# EAGLE design M7821 (EAGLE 6.6.0)
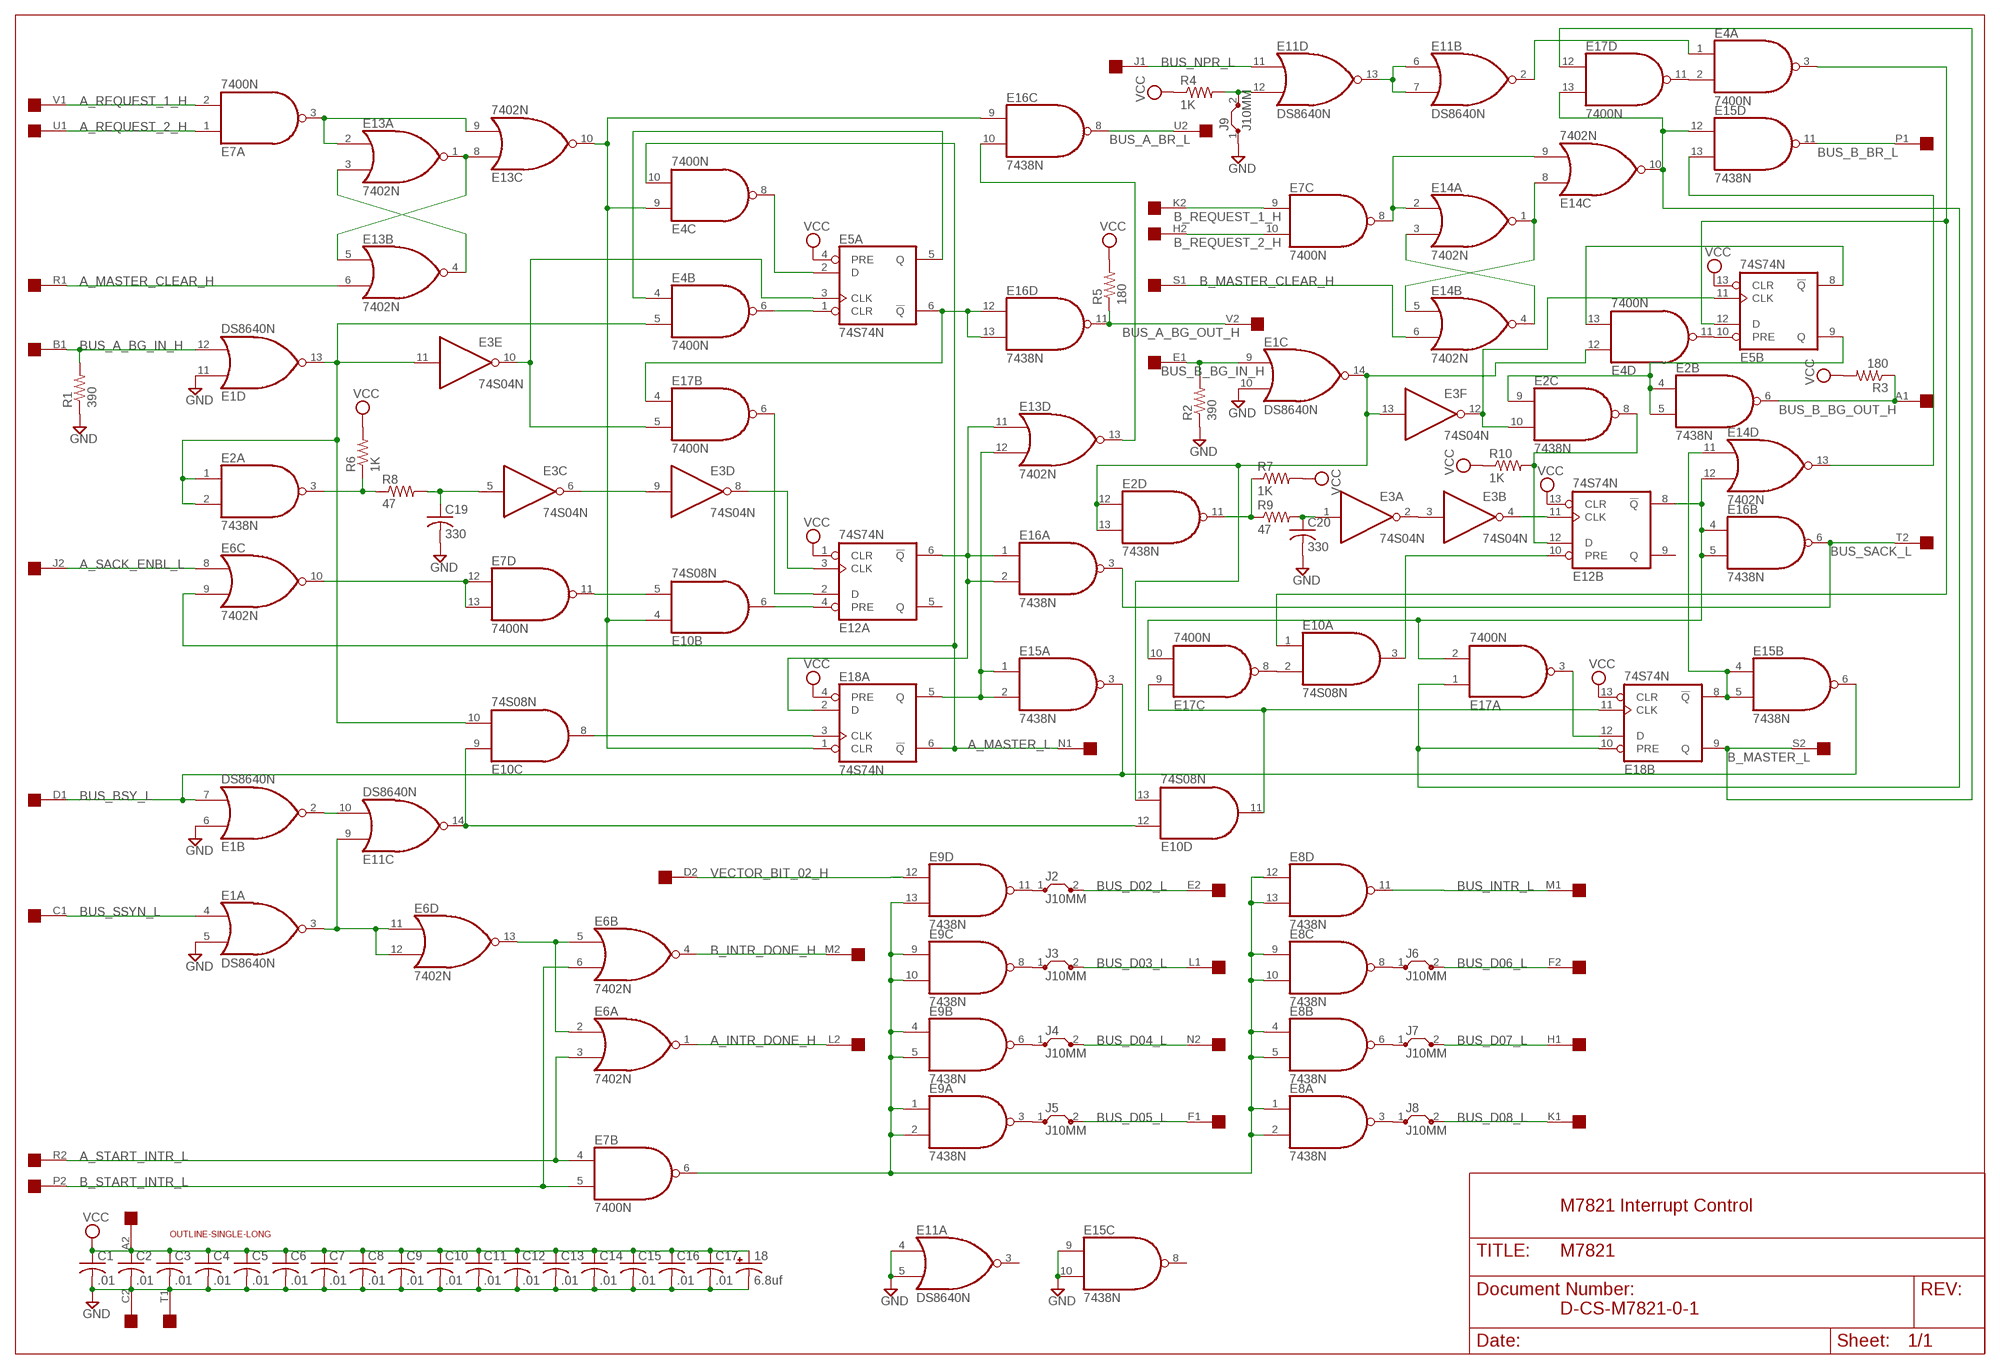
[diagram p0: schematic, sheet 1]

## Parts
18  6.8uf  CPOL-USE15-5AXIAL  [E15-5]
C1  .01  C-US050-025X075  [C050-025X075]
C2  .01  C-US050-025X075  [C050-025X075]
C3  .01  C-US050-025X075  [C050-025X075]
C4  .01  C-US050-025X075  [C050-025X075]
C5  .01  C-US050-025X075  [C050-025X075]
C6  .01  C-US050-025X075  [C050-025X075]
C7  .01  C-US050-025X075  [C050-025X075]
C8  .01  C-US050-025X075  [C050-025X075]
C9  .01  C-US050-025X075  [C050-025X075]
C10  .01  C-US050-025X075  [C050-025X075]
C11  .01  C-US050-025X075  [C050-025X075]
C12  .01  C-US050-025X075  [C050-025X075]
C13  .01  C-US050-025X075  [C050-025X075]
C14  .01  C-US050-025X075  [C050-025X075]
C15  .01  C-US050-025X075  [C050-025X075]
C16  .01  C-US050-025X075  [C050-025X075]
C17  .01  C-US050-025X075  [C050-025X075]
C19  330  C-US050-025X075  [C050-025X075]
C20  330  C-US050-025X075  [C050-025X075]
E1  DS8640N  [DIL14]
E2  7438N  [DIL14]
E3  74S04N  [DIL14]
E4  7400N  [DIL14]
E5  74S74N  [DIL14]
E6  7402N  [DIL14]
E7  7400N  [DIL14]
E8  7438N  [DIL14]
E9  7438N  [DIL14]
E10  74S08N  [DIL14]
E11  DS8640N  [DIL14]
E12  74S74N  [DIL14]
E13  7402N  [DIL14]
E14  7402N  [DIL14]
E15  7438N  [DIL14]
E16  7438N  [DIL14]
E17  7400N  [DIL14]
E18  74S74N  [DIL14]
J2  J10MM  [10]
J3  J10MM  [10]
J4  J10MM  [10]
J5  J10MM  [10]
J6  J10MM  [10]
J7  J10MM  [10]
J8  J10MM  [10]
J9  J10MM  [10]
R1  390  R-US_0207/10  [0207/10]
R2  390  R-US_0207/10  [0207/10]
R3  180  R-US_0207/10  [0207/10]
R4  1K  R-US_0207/10  [0207/10]
R5  180  R-US_0207/10  [0207/10]
R6  1K  R-US_0207/10  [0207/10]
R7  1K  R-US_0207/10  [0207/10]
R8  47  R-US_0207/10  [0207/10]
R9  47  R-US_0207/10  [0207/10]
R10  1K  R-US_0207/10  [0207/10]
U$1  OUTLINE-SINGLE-LONG  [SINGLE-LONG]
U$2  SINGLE  [EDGE-CON2]

## Nets
A_INTR_DONE_H: E6.1(A:O) U$2.L2
A_MASTER_CLEAR_H: E13.6(B:I1) U$2.R1
A_MASTER_L: E4.10(C:I1) E6.9(C:I1) E18.6(A:!Q) U$2.N1
A_REQUEST_1_H: E7.2(A:I1) U$2.V1
A_REQUEST_2_H: E7.1(A:I0) U$2.U1
A_SACK_ENBL_L: E6.8(C:I0) U$2.J2
A_START_INTR_L: E6.3(A:I1) E7.4(B:I0) U$2.R2
B_INTR_DONE_H: E6.4(B:O) U$2.M2
B_MASTER_CLEAR_H: E14.6(B:I1) U$2.S1
B_MASTER_L: E17.12(D:I0) E18.9(B:Q) U$2.S2
B_REQUEST_1_H: E7.9(C:I0) U$2.K2
B_REQUEST_2_H: E7.10(C:I1) U$2.H2
B_START_INTR_L: E6.6(B:I1) E7.5(B:I1) U$2.P2
BUS_A_BG_IN_H: E1.12(D:I1) R1.2 U$2.B1
BUS_A_BG_OUT_H: E16.11(D:O) R5.1 U$2.V2
BUS_A_BR_L: E16.8(C:O) U$2.U2
BUS_B_BG_IN_H: E1.9(C:I0) R2.2 U$2.E1
BUS_B_BG_OUT_H: E2.6(B:O) R3.1 U$2.A1
BUS_B_BR_L: E15.11(D:O) U$2.P1
BUS_BSY_L: E1.7(B:I1) E15.3(A:O) E15.6(B:O) U$2.D1
BUS_D02_L: J2.2 U$2.E2
BUS_D03_L: J3.2 U$2.L1
BUS_D04_L: J4.2 U$2.N2
BUS_D05_L: J5.2 U$2.F1
BUS_D06_L: J6.2 U$2.F2
BUS_D07_L: J7.2 U$2.H1
BUS_D08_L: J8.2 U$2.K1
BUS_INTR_L: E8.11(D:O) U$2.M1
BUS_NPR_L: E11.11(D:I0) U$2.J1
BUS_SACK_L: E16.3(A:O) E16.6(B:O) U$2.T2
BUS_SSYN_L: E1.4(A:I0) U$2.C1
GND: 18.- C1.2 C2.2 C3.2 C4.2 C5.2 C6.2 C7.2 C8.2 C9.2 C10.2 C11.2 C12.2 C13.2 C14.2 C15.2 C16.2 C17.2 C19.2 C20.2 E1.5(A:I1) E1.6(B:I0) E1.10(C:I1) E1.11(D:I0) E11.4(A:I0) E11.5(A:I1) E15.9(C:I0) E15.10(C:I1) J9.1 R1.1 R2.1 U$2.C2 U$2.T1
N$1: E1.14(C:O) E2.12(D:I0) E2.13(D:I1) E3.13(F:I) E4.12(D:I0) E10.13(D:I1)
N$2: E1.13(D:O) E2.1(A:I0) E2.2(A:I1) E3.11(E:I) E4.5(B:I1) E10.10(C:I1)
N$3: E1.3(A:O) E6.11(D:I0) E6.12(D:I1) E11.9(C:I0)
N$4: E1.2(B:O) E11.10(C:I1)
N$5: E7.8(C:O) E14.2(A:I0) E14.9(C:I1)
N$6: E11.12(D:I1) J9.2 R4.2
N$7: E11.6(B:I0) E11.7(B:I1) E11.13(D:O)
N$8: E6.10(C:O) E7.12(D:I0) E7.13(D:I1)
N$9: E14.3(A:I1) E14.4(B:O)
N$10: E9.11(D:O) J2.1
N$11: E3.8(D:O) E12.3(A:CLK)
N$12: E7.11(D:O) E10.5(B:I1)
N$13: E4.13(D:I1) E5.8(B:!Q)
N$14: E14.1(A:O) E14.5(B:I0) E14.8(C:I0)
N$15: E2.11(D:O) R7.1 R9.1
N$16: E9.3(A:O) J5.1
N$17: E9.6(B:O) J4.1
N$18: E9.8(C:O) J3.1
N$19: E10.9(C:I0) E10.12(D:I0) E11.14(C:O)
N$20: E8.3(A:O) J8.1
N$21: E8.6(B:O) J7.1
N$22: E8.8(C:O) J6.1
N$23: E7.6(B:O) E8.1(A:I0) E8.2(A:I1) E8.4(B:I0) E8.5(B:I1) E8.9(C:I0) E8.10(C:I1) E8.12(D:I0) E8.13(D:I1) E9.1(A:I0) E9.2(A:I1) E9.4(B:I0) E9.5(B:I1) E9.9(C:I0) E9.10(C:I1) E9.13(D:I1)
N$24: E12.6(A:!Q) E13.11(D:I0) E16.1(A:I0) E16.2(A:I1) E18.2(A:D)
N$25: E13.12(D:I1) E15.1(A:I0) E15.2(A:I1) E18.5(A:Q)
N$26: E4.6(B:O) E5.1(A:CLR)
N$27: E4.8(C:O) E5.2(A:D)
N$28: E4.4(B:I0) E5.5(A:Q)
N$29: E3.10(E:O) E5.3(A:CLK) E17.5(B:I1)
N$30: E12.2(A:D) E17.6(B:O)
N$31: E5.6(A:!Q) E16.12(D:I0) E16.13(D:I1) E17.4(B:I0)
N$32: E13.13(D:O) E16.10(C:I1)
N$33: C20.1 E3.1(A:I) R9.2
N$34: E6.2(A:I0) E6.5(B:I0) E6.13(D:O)
N$35: E3.2(A:O) E3.3(B:I)
N$36: E3.4(B:O) E12.11(B:CLK)
N$37: E10.6(B:O) E12.4(A:PRE)
N$38: E2.3(A:O) R6.1 R8.1
N$39: C19.1 E3.5(C:I) R8.2
N$40: E3.6(C:O) E3.9(D:I)
N$41: E10.11(D:O) E17.9(C:I0) E18.11(B:CLK)
N$42: E7.3(A:O) E13.2(A:I0) E13.9(C:I1)
N$43: E13.1(A:O) E13.5(B:I0) E13.8(C:I0)
N$44: E13.3(A:I1) E13.4(B:O)
N$45: E4.9(C:I0) E10.4(B:I0) E13.10(C:O) E16.9(C:I0) E18.1(A:CLR)
N$46: E10.8(C:O) E18.3(A:CLK)
N$47: E4.1(A:I0) E11.2(B:O)
N$48: E14.11(D:I0) E15.4(B:I0) E15.5(B:I1) E18.8(B:!Q)
N$49: E17.3(A:O) E18.12(B:D)
N$50: E14.10(C:O) E15.12(D:I0) E17.1(A:I0) E17.13(D:I1) E18.10(B:PRE)
N$51: E10.2(A:I1) E17.8(C:O)
N$52: E12.8(B:!Q) E14.12(D:I1) E16.4(B:I0) E16.5(B:I1) E17.2(A:I1) E17.10(C:I1)
N$53: E10.3(A:O) E12.10(B:PRE)
N$54: E4.3(A:O) E5.12(B:D) E10.1(A:I0)
N$55: E2.8(C:O) E12.12(B:D) R10.2
N$56: E2.10(C:I1) E3.12(F:O) E5.11(B:CLK)
N$57: E2.4(B:I0) E2.5(B:I1) E2.9(C:I0) E5.9(B:Q)
N$58: E4.11(D:O) E5.10(B:PRE)
N$60: E4.2(A:I1) E17.11(D:O)
N$61: E14.13(D:O) E15.13(D:I1)
VCC: 18.+ C1.1 C2.1 C3.1 C4.1 C5.1 C6.1 C7.1 C8.1 C9.1 C10.1 C11.1 C12.1 C13.1 C14.1 C15.1 C16.1 C17.1 E5.4(A:PRE) E5.13(B:CLR) E12.1(A:CLR) E12.13(B:CLR) E18.4(A:PRE) E18.13(B:CLR) R3.2 R4.1 R5.2 R6.2 R7.2 R10.1 U$2.A2
VECTOR_BIT_02_H: E9.12(D:I0) U$2.D2
Unconnected: E11.3(A:O) E12.5(A:Q) E12.9(B:Q) E15.8(C:O) U$2.B2

## Notes on the sheet
- M7821 Interrupt Control
- D-CS-M7821-0-1

## Power pins joined to a net without a drawn wire
GND: E1.1(P:GND) E2.7(P:GND) E3.7(P:GND) E4.7(P:GND) E5.7(P:GND) E6.7(P:GND) E7.7(P:GND) E8.7(P:GND) E9.7(P:GND) E10.7(P:GND) E11.1(P:GND) E12.7(P:GND) E13.7(P:GND) E14.7(P:GND) E15.7(P:GND) E16.7(P:GND) E17.7(P:GND) E18.7(P:GND)
VCC: E1.8(P:VCC) E2.14(P:VCC) E3.14(P:VCC) E4.14(P:VCC) E5.14(P:VCC) E6.14(P:VCC) E7.14(P:VCC) E8.14(P:VCC) E9.14(P:VCC) E10.14(P:VCC) E11.8(P:VCC) E12.14(P:VCC) E13.14(P:VCC) E14.14(P:VCC) E15.14(P:VCC) E16.14(P:VCC) E17.14(P:VCC) E18.14(P:VCC)

## Library data of the parts
18 = rcl:CPOL-US: POLARIZED CAPACITOR, American symbol
C1-C17 C19 C20 = rcl:C-US: CAPACITOR, American symbol
E1 E11 = dec-con:DS8640: Quad NOR gate
E2 E8 E9 E15 E16 = dec-con:74*38: Quad 2-input NAND gate, open collector output
E3 = 74xx-us:74*04: Hex INVERTER
E4 E7 E17 = 74xx-us:74*00: Quad 2-input NAND gate
E5 E12 E18 = 74xx-us:74*74: Dual D type positive edge triggered FLIP FLOP, preset and clear
E6 E13 E14 = 74xx-us:74*02: Quad 2-input NOR gate
E10 = 74xx-us:74*08: Quad 2-input AND gate
J2-J9 = jumper:J: Bridge
R1-R10 = rcl:R-US_: RESISTOR, American symbol
U$1 = dec-con:OUTLINE-*: Board outlines for DEC boards.
U$2 = dec-con:SINGLE: Single-Height DEC board

## Board
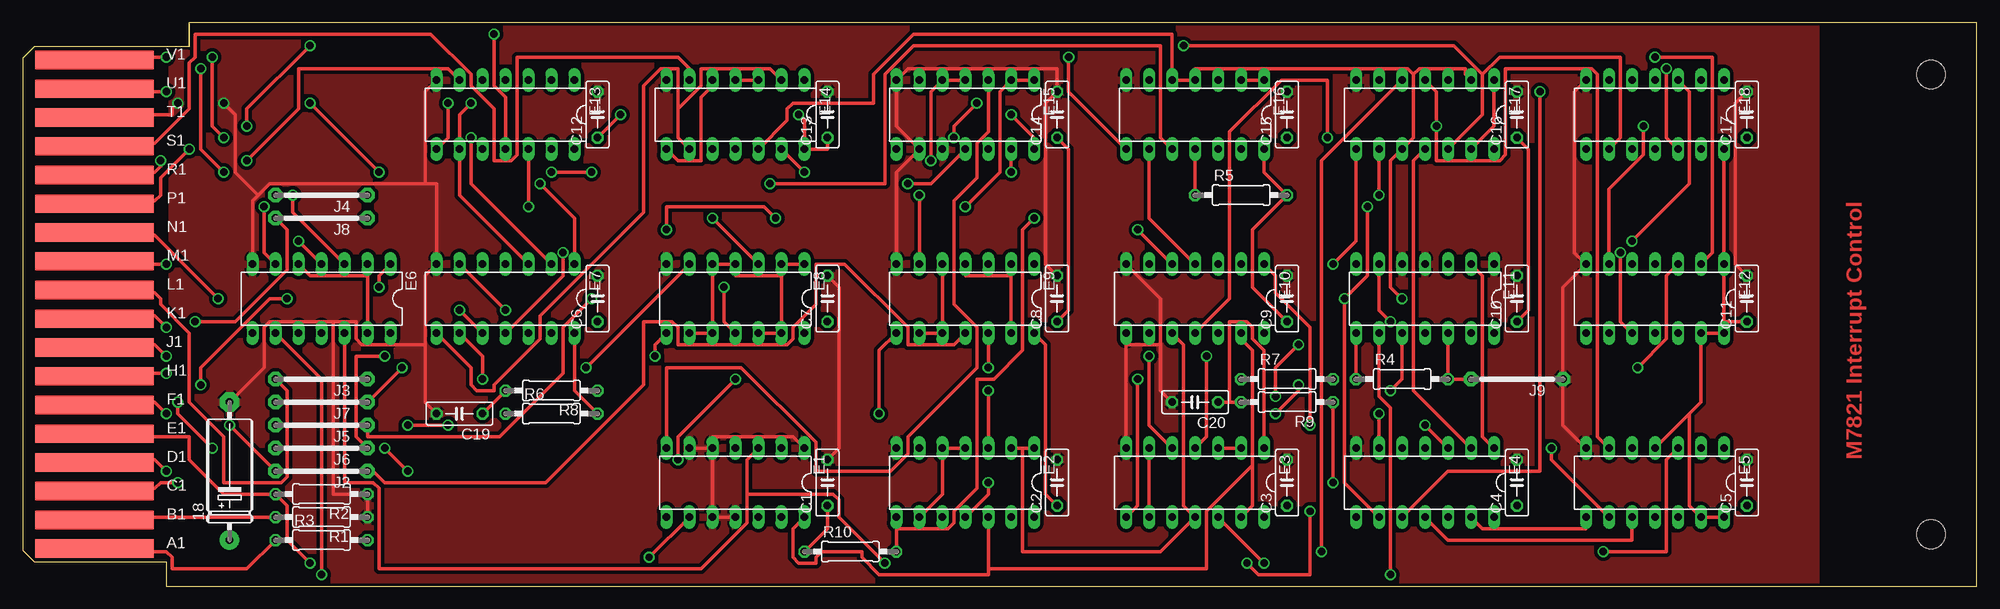
[diagram p1: board, top side]
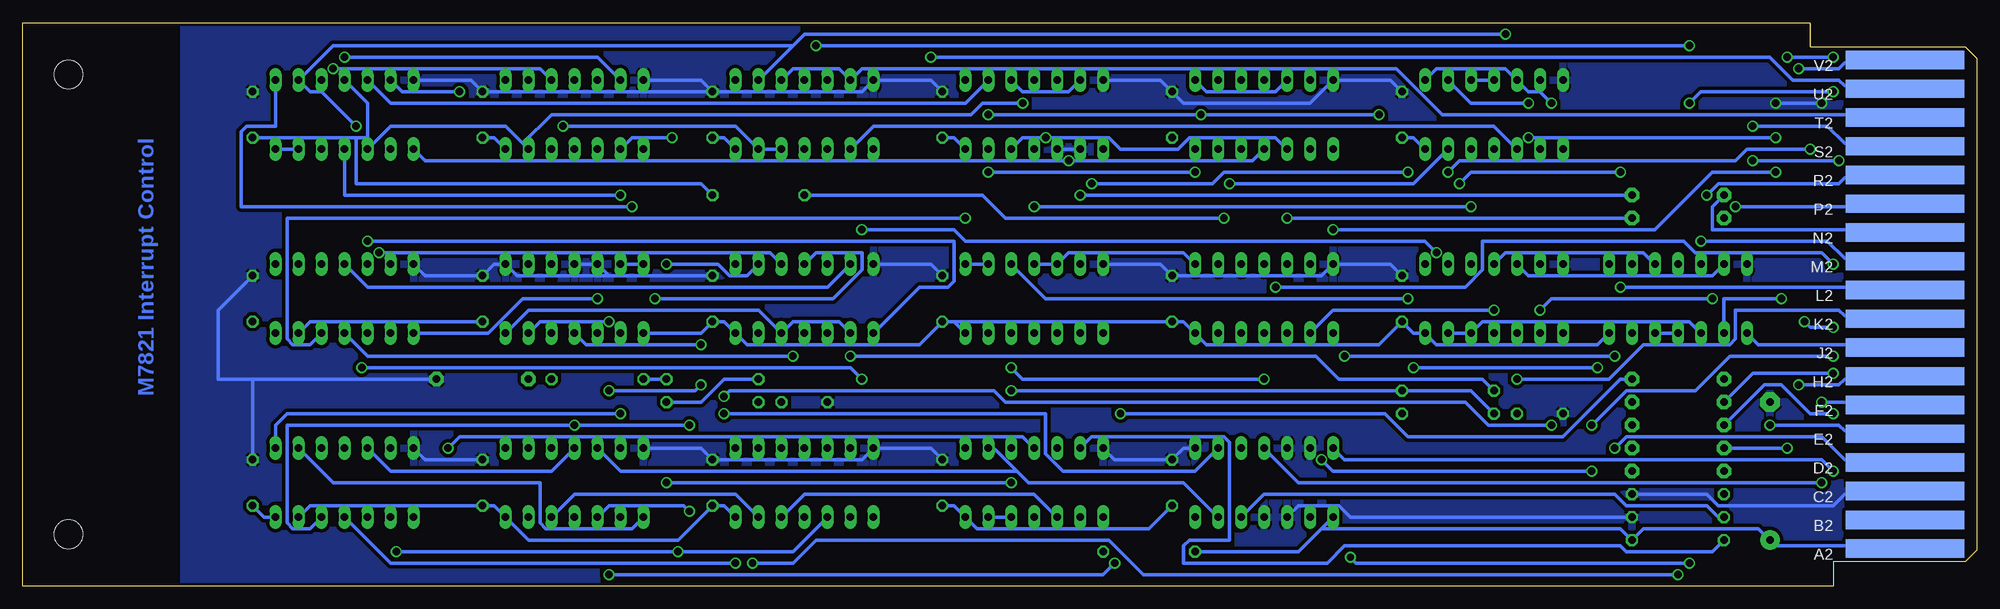
[diagram p2: board, bottom side, seen from below]

Size 215.9 x 62.23 mm. Coordinates in mm from the lower left corner, seen from the top.
Copper layers (1+16): Top 0.035mm / dielectric 1.5mm / Bottom 0.035mm
Design rules "16mils": minimum track width 16mil, minimum drill 32mil, track to track 15mil, track to pad 10mil, pad to pad 10mil, via to via 10mil, smd to smd 10mil, copper to edge 13mil, drill to drill 10mil, minimum pad ring 10mil, minimum via ring 8mil, stop-mask expansion 0mil, vias tented up to drill 0mil, thermal gap 10mil

### Footprints (pad centres in the part's own frame; a part is rotated, then mirrored left to right if it is on the bottom)
E15-5 = drill 0.813 pad 2.159: + -7.62,0 | drill 0.813 pad 2.159 octagon: - 7.62,0
C050-025X075 = drill 0.813 octagon: 1 -2.54,0; 2 2.54,0
DIL14 = drill 0.813 long: 1 -7.62,-3.81; 2 -5.08,-3.81; 3 -2.54,-3.81; 4 0,-3.81; 5 2.54,-3.81; 6 5.08,-3.81; 7 7.62,-3.81; 8 7.62,3.81; 9 5.08,3.81; 10 2.54,3.81; 11 0,3.81; 12 -2.54,3.81; 13 -5.08,3.81; 14 -7.62,3.81
10 = drill 0.813 pad 1.6 octagon: 1 -5.08,0; 2 5.08,0
0207/10 = drill 0.813 octagon: 1 -5.08,0; 2 5.08,0
SINGLE-LONG = hole 3.175: 210.82,56.515; 210.82,5.715
EDGE-CON2 = smd 13.106 x 2.032: A1 7.938,4.128; B1 7.938,7.303; C1 7.938,10.477; D1 7.938,13.652; E1 7.938,16.828; F1 7.938,20.003; H1 7.938,23.177; J1 7.938,26.352; K1 7.938,29.527; L1 7.938,32.703; M1 7.938,35.877; N1 7.938,39.053; P1 7.938,42.227; R1 7.938,45.403; S1 7.938,48.578; T1 7.938,51.752; U1 7.938,54.928; V1 7.938,58.102 | smd 13.106 x 2.032 bottom: A2 7.938,4.128; B2 7.938,7.303; C2 7.938,10.477; D2 7.938,13.652; E2 7.938,16.828; F2 7.938,20.003; H2 7.938,23.177; J2 7.938,26.352; K2 7.938,29.527; L2 7.938,32.703; M2 7.938,35.877; N2 7.938,39.053; P2 7.938,42.227; R2 7.938,45.403; S2 7.938,48.578; T2 7.938,51.752; U2 7.938,54.928; V2 7.938,58.102

### Placement (x,y rotation side)
18  22.86,12.7 90 top
C1  88.9,11.43 90 top
C2  114.3,11.43 90 top
C3  139.7,11.43 90 top
C4  165.1,11.43 90 top
C5  190.5,11.43 90 top
C6  63.5,31.75 90 top
C7  88.9,31.75 90 top
C8  114.3,31.75 90 top
C9  139.7,31.75 90 top
C10  165.1,31.75 90 top
C11  190.5,31.75 90 top
C12  63.5,52.07 90 top
C13  88.9,52.07 90 top
C14  114.3,52.07 90 top
C15  139.7,52.07 90 top
C16  165.1,52.07 90 top
C17  190.5,52.07 90 top
C19  48.26,19.05 180 top
C20  129.54,20.32 180 top
E1  78.74,11.43 180 top
E2  104.14,11.43 180 top
E3  129.54,11.43 180 top
E4  154.94,11.43 180 top
E5  180.34,11.43 180 top
E6  33.02,31.75 180 top
E7  53.34,31.75 180 top
E8  78.74,31.75 180 top
E9  104.14,31.75 180 top
E10  129.54,31.75 180 top
E11  154.94,31.75 180 top
E12  180.34,31.75 180 top
E13  53.34,52.07 180 top
E14  78.74,52.07 180 top
E15  104.14,52.07 180 top
E16  129.54,52.07 180 top
E17  154.94,52.07 180 top
E18  180.34,52.07 180 top
J2  33.02,12.7 180 top
J3  33.02,22.86 180 top
J4  33.02,43.18 180 top
J5  33.02,17.78 180 top
J6  33.02,15.24 180 top
J7  33.02,20.32 180 top
J8  33.02,40.64 180 top
J9  165.1,22.86 180 top
R1  33.02,7.62 180 top
R2  33.02,10.16 180 top
R3  33.02,5.08 0 top
R4  152.4,22.86 0 top
R5  134.62,43.18 0 top
R6  58.42,19.05 0 top
R7  139.7,22.86 0 top
R8  58.42,21.59 180 top
R9  139.7,20.32 180 top
R10  91.44,3.81 0 top
U$1  0,0 0 top
U$2  0,0 0 top

### Tracks (layer width: path | path; a pad name or v marks a point on that pad's centre or on a via)
A_INTR_DONE_H  (via drill 0.81)
  Top 0.406: E6.1 39.37,34.29 v39.37,33.02
  Bottom 0.406: v39.37,33.02 8.26,33.02 U$2.L2
A_MASTER_CLEAR_H  (via drill 0.81)
  Top 0.406: E13.6 46.99,57.15 30.48,57.15 30.48,52.7 v24.77,46.99 | v15.24,46.99 15.24,46.35 14.61,45.72 8.26,45.72 U$2.R1
  Bottom 0.406: v15.24,46.99 v24.77,46.99
A_MASTER_L  (via drill 0.81)
  Top 0.406: v21.59,31.75 14.61,38.73 8.26,38.73 U$2.N1 | E4.10 157.48,12.7 167.64,12.7 v167.64,54.61 | E6.9 33.02,22.86 v33.02,1.27 | v135.26,2.54 136.53,1.27 142.24,1.27 v142.24,8.26
  Bottom 0.406: E6.9 27.94,31.75 v21.59,31.75 | v167.64,54.61 173.99,54.61 E18.6 | v33.02,1.27 92.08,1.27 95.89,5.08 128.27,5.08 130.81,2.54 v135.26,2.54 | v142.24,8.26 142.88,8.89 151.13,8.89 E4.10
A_REQUEST_1_H  (via drill 0.81)
  Top 0.406: E7.2 49.53,44.45 v49.53,49.53 | v22.23,49.53 20.96,50.8 v20.96,58.42 | v15.88,58.42 8.26,58.42 U$2.V1
  Bottom 0.406: v22.23,49.53 v49.53,49.53 | v15.88,58.42 v20.96,58.42
A_REQUEST_2_H  (via drill 0.81)
  Top 0.406: E7.1 60.96,40.64 v57.15,44.45 | v31.75,53.34 v39.37,45.72 | v15.88,54.61 8.26,54.61 U$2.U1
  Bottom 0.406: v57.15,44.45 55.88,45.72 v39.37,45.72 | v31.75,53.34 30.48,54.61 v15.88,54.61
A_SACK_ENBL_L
  Bottom 0.406: E6.8 24.13,26.67 8.26,26.67 U$2.J2
A_START_INTR_L  (via drill 0.81)
  Top 0.406: E6.3 29.85,41.27 v29.85,43.18
  Bottom 0.406: E6.3 36.83,36.83 52.07,36.83 E7.4 | v29.85,43.18 28.58,44.45 15.24,44.45 14.61,45.09 8.26,45.09 U$2.R2
B_INTR_DONE_H  (via drill 0.81)
  Top 0.406: v30.48,38.1 E6.4
  Bottom 0.406: v30.48,38.1 16.51,38.1 14.61,36.2 8.26,36.2 U$2.M2
B_MASTER_CLEAR_H
  Top 0.406: E14.6 73.66,57.15 72.39,58.42 54.61,58.42 54.61,47.62 53.98,46.99 52.07,46.99 52.07,52.7 49.53,55.24 49.53,56.52 45.09,60.96 19.05,60.96 19.05,58.42 18.42,57.78 18.42,52.7 14.61,48.9 8.26,48.9 U$2.S1
B_MASTER_L  (via drill 0.81)
  Top 0.406: E17.12 161.29,52.07 161.29,56.52 | 161.29,56.52 163.2,58.42 176.53,58.42 176.53,49.53 E18.9 | 161.29,56.52 158.12,59.69 v128.27,59.69 | v31.75,59.69 24.77,52.7 v24.77,50.8
  Bottom 0.406: v31.75,59.69 v128.27,59.69 | v24.77,50.8 16.51,50.8 14.61,48.9 8.26,48.9 U$2.S2
B_REQUEST_1_H  (via drill 0.81)
  Top 0.406: E7.9 50.8,25.4 v50.8,22.86
  Bottom 0.406: v50.8,22.86 40.64,22.86 36.83,26.67 27.31,26.67 26.67,27.3 26.67,30.48 15.24,30.48 14.61,29.84 8.26,29.84 U$2.K2
B_REQUEST_2_H  (via drill 0.81)
  Top 0.406: v48.26,30.48 E7.10 | v29.21,31.75 27.31,31.75 19.69,24.13 v19.69,22.23
  Bottom 0.406: v48.26,30.48 46.99,31.75 v29.21,31.75 | v19.69,22.23 15.24,22.23 14.61,22.86 8.26,22.86 U$2.H2
B_START_INTR_L  (via drill 0.81)
  Top 0.406: E6.6 26.67,36.83 v26.67,41.91
  Bottom 0.406: E6.6 29.21,34.29 49.53,34.29 E7.5 | v26.67,41.91 8.26,41.91 U$2.P2
BUS_A_BG_IN_H
  Top 0.406: R1.2 8.26,7.62 U$2.B1
  Bottom 0.406: E1.12 78.74,10.16 40.01,10.16 38.74,8.89 29.85,8.89 28.58,7.62 R1.2
BUS_A_BG_OUT_H  (via drill 0.81)
  Top 0.406: E16.11 R5.1 | v83.19,40.64 81.92,41.91 71.12,41.91 v71.12,39.37 | v22.23,45.72 19.69,48.26 v19.69,57.15
  Bottom 0.406: R5.1 109.86,43.18 107.32,40.64 v83.19,40.64 | v71.12,39.37 35.56,39.37 29.21,45.72 v22.23,45.72 | v19.69,57.15 15.24,57.15 14.61,57.78 8.26,57.78 U$2.V2
BUS_A_BR_L  (via drill 0.81)
  Top 0.406: E16.8 115.57,54.61 v115.57,58.42
  Bottom 0.406: v115.57,58.42 22.86,58.42 20.32,55.88 15.24,55.88 14.61,55.24 8.26,55.24 U$2.U2
BUS_B_BG_IN_H  (via drill 0.81)
  Top 0.406: v69.22,3.17 E1.9 | v31.75,2.54 29.21,5.08 29.21,8.89 R2.2 22.23,10.16 18.42,13.97 18.42,16.51 8.26,16.51 U$2.E1
  Bottom 0.406: v69.22,3.17 68.58,2.54 v31.75,2.54
BUS_B_BG_OUT_H
  Top 0.406: R3.1 24.77,1.91 16.51,1.91 16.51,3.17 15.88,3.81 8.26,3.81 U$2.A1
  Bottom 0.406: E2.6 97.79,16.51 83.19,16.51 82.55,15.88 82.55,5.08 87,5.08 87.63,4.45 87.63,2.54 71.76,2.54 69.85,4.45 39.37,4.45 38.74,3.81 29.21,3.81 R3.1
BUS_B_BR_L  (via drill 0.81)
  Top 0.406: E15.11 100.33,44.45 v97.79,44.45 | v58.42,45.72 v62.87,45.72 | v18.42,48.26 15.24,45.09 15.24,43.18 14.61,42.55 8.26,42.55 U$2.P1
  Bottom 0.406: v97.79,44.45 84.46,44.45 83.19,45.72 v62.87,45.72 | v58.42,45.72 57.15,46.99 26.67,46.99 25.4,48.26 v18.42,48.26
BUS_BSY_L  (via drill 0.81)
  Top 0.406: v15.88,12.7 14.61,13.97 8.26,13.97 U$2.D1 | E15.3 106.68,50.16 105.41,48.9 105.41,45.09 102.87,42.55 102.87,31.11 105.41,28.57 105.41,24.13 97.79,16.51 97.79,14.61 95.89,12.7 87.63,12.7 87.63,15.88 79.38,24.13 71.12,24.13 E1.7
  Bottom 0.406: E15.6 100.33,54.61 105.41,54.61 E15.3 | E1.7 69.85,13.97 17.15,13.97 v15.88,12.7
BUS_D02_L  (via drill 0.81)
  Top 0.406: v22.86,17.78 J2.2
  Bottom 0.406: v22.86,17.78 15.24,17.78 14.61,17.14 8.26,17.14 U$2.E2
BUS_D03_L
  Top 0.406: J3.2 29.21,21.59 29.21,12.06 28.58,11.43 22.23,11.43 22.23,16.51 18.42,20.32 18.42,27.94 15.24,31.11 15.24,31.75 14.61,32.38 8.26,32.38 U$2.L1
BUS_D04_L
  Bottom 0.406: J4.2 29.21,41.91 29.21,39.37 8.26,39.37 U$2.N2
BUS_D05_L  (via drill 0.81)
  Top 0.406: v15.88,19.05 14.61,20.32 8.26,20.32 U$2.F1
  Bottom 0.406: J5.2 23.5,22.23 21.59,22.23 18.42,19.05 v15.88,19.05
BUS_D06_L  (via drill 0.81)
  Top 0.406: v20.96,15.24 17.15,19.05 v17.15,20.32
  Bottom 0.406: v20.96,15.24 J6.2 | v17.15,20.32 8.26,20.32 U$2.F2
BUS_D07_L  (via drill 0.81)
  Top 0.406: v15.88,23.5 8.26,23.5 U$2.H1
  Bottom 0.406: J7.2 24.77,23.5 v15.88,23.5
BUS_D08_L  (via drill 0.81)
  Top 0.406: J8.2 29.21,39.37 29.21,34.92 23.5,29.21 v19.05,29.21 | v15.88,28.57 14.61,29.84 8.26,29.84 U$2.K1
  Bottom 0.406: v19.05,29.21 18.42,28.57 v15.88,28.57
BUS_INTR_L  (via drill 0.81)
  Top 0.406: E8.11 77.47,29.21 v77.47,33.02 | v15.88,35.56 8.26,35.56 U$2.M1
  Bottom 0.406: v77.47,33.02 56.52,33.02 54.61,34.92 54.61,38.1 32.39,38.1 31.12,36.83 17.15,36.83 v15.88,35.56
BUS_NPR_L  (via drill 0.81)
  Top 0.406: v140.97,26.67 138.43,24.13 v138.43,20.95 | v42.55,17.78 v46.99,17.78 | v15.88,25.4 14.61,26.67 8.26,26.67 U$2.J1
  Bottom 0.406: E11.11 153.67,26.67 v140.97,26.67 | v138.43,20.95 137.8,21.59 108.59,21.59 107.32,20.32 56.52,20.32 53.98,17.78 v46.99,17.78 | v42.55,17.78 38.74,21.59 31.12,21.59 27.31,25.4 v15.88,25.4
BUS_SACK_L
  Bottom 0.406: E16.3 130.81,57.15 125.73,57.15 E16.6 123.19,57.15 64.14,57.15 59.06,52.07 8.26,52.07 U$2.T2
BUS_SSYN_L  (via drill 0.81)
  Top 0.406: v17.15,11.43 15.24,11.43 14.61,10.79 8.26,10.79 U$2.C1
  Bottom 0.406: E1.4 74.93,11.43 v17.15,11.43
GND  (via drill 0.81)
  Top 0.406: R1.1 R2.1 34.29,10.16 34.29,29.21 | C19.2 44.45,20.32 44.45,26.67 | 44.45,26.67 44.45,34.29 E7.7 45.72,44.45 44.45,44.45 | E6.7 25.4,42.55 26.04,43.18 | 26.04,43.18 27.31,44.45 44.45,44.45 | E13.7 44.45,54.61 44.45,44.45 | 18.- 26.67,24.13 26.67,28.57 27.31,29.21 34.29,29.21 | 34.29,29.21 36.83,29.21 36.83,27.3 37.47,26.67 44.45,26.67 | v17.15,53.34 16.51,52.7 16.51,52.07 8.26,52.07 U$2.T1 | v22.23,53.34 23.5,52.07 23.5,45.72 26.04,43.18 | C17.2 189.23,53.34 189.23,35.56 C11.2 | E5.7 170.18,17.78 J9.1 170.18,33.02 E12.7 171.45,36.83 171.45,54.61 E18.7 | E1.11 E1.10 E1.5 | E1.5 E1.6 | E1.1 85.09,16.51 76.2,16.51 E1.5 | C1.2 90.17,15.24 90.17,33.02 C7.2 | E9.7 96.52,45.72 E15.9 96.52,50.8 E15.7 97.79,57.15 114.3,57.15 C14.2 113.03,53.34 113.03,35.56 C8.2 | C20.2 125.73,21.59 125.73,26.67 | 125.73,26.67 125.73,31.75 E10.7 | 125.73,26.67 121.92,26.67 E3.7
  Bottom 0.406: R2.1 29.85,10.16 28.58,8.89 15.88,8.89 14.61,10.16 8.26,10.16 U$2.C2 | v22.23,53.34 v17.15,53.34 | E12.7 171.45,34.29 C10.2 163.83,35.56 E11.1 161.29,34.29 151.13,34.29 | 151.13,34.29 C9.2 | 151.13,34.29 E11.5 E11.4 | C4.2 171.45,13.97 E5.7 | 190.5,22.86 C5.2 | J9.1 190.5,22.86 | C11.2 194.31,30.48 194.31,22.86 190.5,22.86 | C12.2 64.77,55.88 E14.7 73.66,53.34 87.63,53.34 C13.2 90.17,55.88 E15.7 | E15.10 E15.9 | E1.1 87.63,15.24 C1.2 95.25,13.97 E2.7 | C6.2 64.77,35.56 E8.7 72.39,34.29 C7.2 90.17,35.56 E9.7 | C8.2 115.57,35.56 E10.7 | C2.2 115.57,15.24 E3.7 123.19,13.97 C3.2 140.97,15.24 E4.7 | E18.7 166.37,55.88 C16.2 C15.2 | C14.2 115.57,55.88 E16.7 123.19,54.61 C15.2 | C15.2 140.97,55.88 E17.7 | R1.1 69.22,7.62 70.49,8.89 74.93,8.89 E1.10
  pour Top: 16.51,62.23 198.12,62.23 198.12,0 16.51,0
  pour Bottom: 13.97,62.23 198.12,62.23 198.12,2.54 13.97,2.54
  pour Bottom: 15.24,62.23 198.12,62.23 198.12,0 15.24,0
N$1
  Top 0.406: E1.14 85.09,6.35 85.09,3.17 85.73,2.54 87.63,2.54 87.63,3.17 88.27,3.81 92.71,3.81 92.71,3.17 94.62,1.27 106.68,1.27 106.68,1.91 | E2.12 106.68,1.91 | E3.13 135.89,8.89 135.89,13.34 | 135.89,13.34 135.89,26.04 134.62,27.3 E10.13 | 106.68,1.91 130.81,1.91 130.81,8.26 135.89,13.34
  Bottom 0.406: E2.12 E2.13 | E4.12 154.94,10.16 137.16,10.16 E3.13
N$2
  Top 0.406: E10.10 128.27,26.67 128.27,8.89 E3.11 125.73,3.81 110.49,3.81 110.49,15.24 | E2.2 110.49,15.24 | 110.49,15.24 E2.1
  Bottom 0.406: E1.13 87.63,11.43 104.78,11.43 106.05,12.7 | 106.05,12.7 108.59,15.24 E2.2 | E4.5 149.86,12.7 106.05,12.7
N$3  (via drill 0.81)
  Top 0.406: E1.3 80.01,13.97 80.01,10.16 | 80.01,10.16 80.01,6.99 74.93,1.91 39.37,1.91 39.37,10.79 38.74,11.43 35.56,11.43 E6.12 | E11.9 149.86,20.95 151.13,19.68 v151.13,1.27 | v95.25,2.54 90.17,7.62 90.17,9.53 89.54,10.16 80.01,10.16
  Bottom 0.406: E6.12 E6.11 | v151.13,1.27 96.52,1.27 v95.25,2.54
N$4  (via drill 0.81)
  Top 0.406: v138.43,19.05 140.97,21.59 v140.97,22.23 | v151.13,21.59 152.4,22.86 E11.10
  Bottom 0.406: E1.2 86.36,12.7 100.97,12.7 102.87,14.61 102.87,19.05 v138.43,19.05 | v140.97,22.23 141.61,21.59 v151.13,21.59
N$5
  Top 0.406: E7.8 49.53,24.13 49.53,22.23 50.17,21.59 52.07,21.59 52.07,22.23 57.15,27.3 57.15,29.84 68.58,41.27 68.58,55.24 70.49,57.15 72.39,57.15 72.39,52.7 | 72.39,52.7 72.39,49.53 E14.9 | E14.2 82.55,57.15 74.93,57.15 74.93,55.24 72.39,52.7
N$6
  Top 0.406: J9.2 R4.2 E11.12
N$7  (via drill 0.81)
  Top 0.406: v151.13,29.21 149.86,30.48 E11.6
  Bottom 0.406: E11.6 E11.7 | E11.13 158.75,29.21 v151.13,29.21
N$8
  Bottom 0.406: E6.10 31.75,29.21 54.61,29.21 E7.12 E7.13
N$9
  Top 0.406: E14.3 E14.4
N$10
  Top 0.406: E9.11 102.87,26.67 97.79,26.67 97.79,28.57 90.81,35.56 87.63,35.56 87.63,31.11 85.09,28.57 85.09,27.3 84.46,26.67 72.39,26.67 72.39,28.57 71.76,29.21 68.58,29.21 68.58,22.23 57.79,11.43 40.01,11.43 38.74,12.7 J2.1
N$11  (via drill 0.81)
  Top 0.406: E3.8 123.19,8.89 v123.19,22.86 | v178.44,24.13 181.61,27.3 181.61,34.29 E12.3
  Bottom 0.406: v123.19,22.86 124.46,24.13 v178.44,24.13
N$12  (via drill 0.81)
  Top 0.406: E7.11 59.69,34.29 v59.69,36.83 | E10.5 v123.19,39.37
  Bottom 0.406: v59.69,36.83 60.96,38.1 111.76,38.1 113.03,39.37 v123.19,39.37
N$13
  Top 0.406: E4.13 161.29,6.35 172.72,6.35 E5.8
N$14
  Top 0.406: E14.8 72.39,46.99 74.93,46.99 74.93,53.98 76.2,55.24 E14.5
  Bottom 0.406: E14.1 85.09,54.61 77.47,54.61 E14.5
N$15  (via drill 0.81)
  Top 0.406: E2.11 106.68,10.16 v106.68,11.43 | R9.1 v144.78,11.43
  Bottom 0.406: v144.78,11.43 v106.68,11.43 | R7.1 138.43,22.86 140.97,20.32 R9.1
N$16  (via drill 0.81)
  Top 0.406: v62.87,31.75 59.69,28.57 59.69,23.5 52.71,16.51 38.1,16.51 J5.1
  Bottom 0.406: E9.3 102.87,31.75 v62.87,31.75
N$17  (via drill 0.81)
  Top 0.406: v99.06,43.18 E9.6
  Bottom 0.406: J4.1 v99.06,43.18
N$18  (via drill 0.81)
  Top 0.406: E9.8 94.62,26.04 v94.62,19.05
  Bottom 0.406: v94.62,19.05 65.41,19.05 62.87,16.51 45.72,16.51 39.37,22.86 J3.1
N$19
  Bottom 0.406: E10.9 125.73,29.21 130.81,29.21 E10.12 134.62,30.48 160.02,30.48 E11.14
N$20  (via drill 0.81)
  Top 0.406: v76.2,40.64 E8.3
  Bottom 0.406: J8.1 v76.2,40.64
N$21  (via drill 0.81)
  Top 0.406: v62.23,24.13 E8.6 | J7.1 v41.91,24.13
  Bottom 0.406: v41.91,24.13 v62.23,24.13
N$22  (via drill 0.81)
  Top 0.406: E8.8 69.85,26.67 v69.85,25.4 | v40.01,25.4 36.83,25.4 36.83,16.51 J6.1
  Bottom 0.406: v40.01,25.4 v69.85,25.4
N$23  (via drill 0.81)
  Top 0.406: E9.2 109.22,34.29 | 109.22,34.29 E9.13 | E9.9 E9.10 E9.5 | 109.22,34.29 104.14,34.29 E9.4 | E8.12 E8.13 83.82,34.29 | E8.1 E8.2 83.82,34.29 | E8.9 E8.10 E8.5 E8.4 78.74,34.29 83.82,34.29 | v53.34,30.48 E7.6
  Bottom 0.406: E9.2 E9.1 | E9.4 E9.5 100.33,36.83 87.63,36.83 E8.1 | v53.34,30.48 71.12,30.48 E8.9
N$24  (via drill 0.81)
  Top 0.406: E12.6 175.26,43.81 179.07,47.62 v179.07,50.8 | E13.11 53.34,53.98 52.07,55.24 v52.07,60.96 | E16.2 E16.1
  Bottom 0.406: v179.07,50.8 182.88,54.61 184.15,54.61 E18.2 181.61,59.69 130.81,59.69 | v52.07,60.96 129.54,60.96 130.81,59.69 | E16.2 130.81,59.69
N$25  (via drill 0.81)
  Top 0.406: v55.88,41.91 E13.12 | v104.14,41.91 107.95,45.72 107.95,54.61 E15.2 E15.1
  Bottom 0.406: v104.14,41.91 v55.88,41.91 | E18.5 175.26,53.34 111.76,53.34 E15.2
N$26  (via drill 0.81)
  Top 0.406: v149.86,19.05 E4.6
  Bottom 0.406: v149.86,19.05 186.69,19.05 187.96,17.78 E5.1
N$27
  Bottom 0.406: E4.8 148.59,6.35 158.12,6.35 158.75,6.99 158.75,11.43 181.61,11.43 E5.2
N$28
  Bottom 0.406: E4.4 157.48,12.7 175.26,12.7 E5.5
N$29  (via drill 0.81)
  Top 0.406: v174.63,3.81 181.61,3.81 181.61,13.97 E5.3 | E17.5 143.51,46.99 v143.51,3.81
  Bottom 0.406: E3.10 130.81,3.81 v143.51,3.81 v174.63,3.81
N$30  (via drill 0.81)
  Top 0.406: v180.34,58.42 186.69,58.42 186.69,36.83 E12.2
  Bottom 0.406: E17.6 152.4,58.42 v180.34,58.42
N$31  (via drill 0.81)
  Top 0.406: E5.6 173.99,16.51 173.99,56.52 173.36,57.15 163.83,57.15 163.83,47.62 163.2,46.99 156.21,46.99 v156.21,50.8 156.21,54.61 E17.4
  Bottom 0.406: E16.12 E16.13 137.16,50.8 v156.21,50.8
N$32  (via drill 0.81)
  Top 0.406: v82.55,44.45 95.25,44.45 95.25,56.52 98.43,59.69 125.73,59.69 125.73,49.53 E16.10
  Bottom 0.406: E13.13 62.23,44.45 v82.55,44.45
N$33
  Top 0.406: R9.2 133.35,20.32 | 133.35,20.32 C20.1 | E3.1 137.16,26.04 135.89,27.3 135.89,28.57 135.26,29.21 133.35,29.21 133.35,20.32
N$34
  Top 0.406: E6.5 31.75,34.29 38.1,34.29 | E6.2 38.1,34.29 | 38.1,34.29 E6.13
N$35
  Top 0.406: E3.2 E3.3
N$36  (via drill 0.81)
  Top 0.406: E3.4 130.81,16.51 v130.81,25.4
  Bottom 0.406: v130.81,25.4 177.8,25.4 E12.11
N$37
  Bottom 0.406: E10.6 127,33.02 177.8,33.02 E12.4
N$38  (via drill 0.81)
  Top 0.406: v106.68,21.59 E2.3
  Bottom 0.406: R6.1 55.88,21.59 R8.1 v106.68,21.59
N$39  (via drill 0.81)
  Top 0.406: R8.2 C19.1 | E3.5 124.46,17.78 v124.46,25.4
  Bottom 0.406: v124.46,25.4 73.03,25.4 70.49,22.86 54.61,22.86 R8.2
N$40
  Top 0.406: E3.6 E3.9
N$41  (via drill 0.81)
  Top 0.406: E10.11 133.35,31.75 133.35,50.16 139.07,55.88 144.15,55.88 v144.15,49.53 | E17.9 v149.86,43.18
  Bottom 0.406: v144.15,49.53 148.59,49.53 E17.9 | E18.11 180.34,43.18 v149.86,43.18
N$42  (via drill 0.81)
  Top 0.406: E7.3 48.26,43.18 E13.9 48.26,52.07 v49.53,53.34
  Bottom 0.406: E13.2 55.88,53.34 v49.53,53.34
N$43  (via drill 0.81)
  Top 0.406: E13.8 46.99,49.53 v46.99,53.34
  Bottom 0.406: v46.99,53.34 48.26,54.61 49.53,54.61 E13.5 52.07,57.15 59.69,57.15 E13.1
N$44
  Bottom 0.406: E13.3 E13.4
N$45  (via drill 0.81)
  Top 0.406: E10.4 124.46,40.64 E16.9 | E4.9 146.05,11.43 v146.05,31.75 148.59,34.29 v148.59,41.91
  Bottom 0.406: E13.10 53.34,50.8 121.92,50.8 E16.9 | v146.05,31.75 126.37,31.75 123.19,34.92 123.19,36.83 128.27,36.83 E10.4 | E18.1 187.96,50.8 191.14,50.8 191.77,50.16 191.77,41.91 v148.59,41.91
N$46  (via drill 0.81)
  Top 0.406: v177.8,38.1 184.15,44.45 184.15,54.61 E18.3
  Bottom 0.406: E10.8 116.84,33.02 113.67,33.02 113.03,33.66 113.03,38.1 v177.8,38.1
N$47
  Top 0.406: E4.1 161.29,16.51 161.29,34.29 E11.2
N$48  (via drill 0.81)
  Top 0.406: v100.33,46.99 100.33,54.61 E15.5 E15.4
  Bottom 0.406: E14.11 80.01,46.99 v100.33,46.99 171.45,46.99 E18.8
N$49  (via drill 0.81)
  Top 0.406: v181.61,57.15 181.61,49.53 E18.12
  Bottom 0.406: E17.3 158.75,57.15 v181.61,57.15
N$50  (via drill 0.81)
  Top 0.406: E17.13 162.56,50.8 E17.1 | v105.41,53.34 102.87,50.8 v102.87,49.53
  Bottom 0.406: E18.10 175.26,50.8 162.56,50.8 160.66,48.9 | E17.13 160.66,48.9 | E14.10 77.47,49.53 87,49.53 88.27,48.26 94.62,48.26 95.89,49.53 v102.87,49.53 105.41,49.53 E15.12 | 160.66,48.9 157.48,52.07 111.13,52.07 109.86,53.34 v105.41,53.34
N$51  (via drill 0.81)
  Top 0.406: v144.78,35.56 147.32,38.1 E17.8
  Bottom 0.406: E10.2 135.89,34.29 137.8,34.29 139.07,35.56 v144.78,35.56
N$52  (via drill 0.81)
  Top 0.406: 153.67,56.52 153.67,49.53 E17.10 151.13,46.99 151.13,33.02 v152.4,31.75 | 153.67,56.52 154.31,57.15 159.39,57.15 159.39,56.52 E17.2 | E14.12 84.46,51.44 84.46,52.7 85.09,53.34 93.98,53.34 93.98,56.52 98.43,60.96 127,60.96 E16.5 E16.4 129.54,57.15 153.04,57.15 153.67,56.52
  Bottom 0.406: E12.8 164.47,27.94 160.66,31.75 v152.4,31.75
N$53  (via drill 0.81)
  Top 0.406: v176.53,36.83 176.53,29.21 E12.10
  Bottom 0.406: E10.3 133.35,36.83 v176.53,36.83
N$54  (via drill 0.81)
  Top 0.406: E10.1 138.43,34.29 138.43,32.38 142.24,28.57 v142.24,17.78 | E4.3 v154.94,17.78
  Bottom 0.406: v142.24,17.78 v154.94,17.78 186.69,17.78 186.69,6.99 186.06,6.35 184.15,6.35 E5.12
N$55  (via drill 0.81)
  Top 0.406: E2.8 96.52,6.35 | 96.52,6.35 R10.2 | v111.76,40.64 110.49,39.37 110.49,26.04 107.32,22.86 105.41,22.86 105.41,10.79 102.87,8.26 102.87,6.99 102.24,6.35 96.52,6.35
  Bottom 0.406: E12.12 184.15,26.67 186.06,26.67 186.69,27.3 186.69,40.64 v111.76,40.64
N$56  (via drill 0.81)
  Top 0.406: E3.12 v137.16,2.54
  Bottom 0.406: E2.10 104.14,10.16 129.54,10.16 E3.12 | E5.11 175.26,2.54 v137.16,2.54
N$57  (via drill 0.81)
  Top 0.406: E2.9 101.6,10.16 E2.5 E2.4 | E5.9 168.91,13.97 v168.91,15.24
  Bottom 0.406: v168.91,15.24 167.64,16.51 105.41,16.51 E2.4
N$58
  Top 0.406: E4.11 157.48,5.08 177.8,5.08 E5.10
N$60
  Top 0.406: E4.2 153.67,21.59 153.67,46.99 E17.11
N$61  (via drill 0.81)
  Top 0.406: v86.36,45.72 E14.13 | E15.13 v109.22,45.72
  Bottom 0.406: v109.22,45.72 v86.36,45.72
VCC  (via drill 0.81)
  Top 0.406: E5.14 E5.13 184.15,8.89 184.15,19.05 | 184.15,19.05 185.42,20.32 E12.13 E12.14 187.96,29.21 | 184.15,19.05 E5.4 | 187.96,29.21 E12.1 E18.14 | 187.96,29.21 C11.1 | C16.1 166.37,48.26 166.37,30.48 C10.1 | E16.14 137.16,45.72 R5.2 135.89,39.37 135.89,33.02 C9.1 | R4.1 E11.8 | R6.2 60.96,21.59 E7.14 | C13.1 88.9,48.26 E14.14 86.36,51.44 v85.73,52.07 | v66.04,52.07 C12.1 | R10.1 88.9,6.35 C1.1 | C2.1 113.03,10.16 113.03,26.67 E9.14 | C14.1 115.57,48.26 115.57,30.48 C8.1 | v109.22,52.07 111.76,49.53 E15.14
  Bottom 0.406: E3.14 138.43,8.89 C3.1 143.51,5.08 160.02,5.08 E4.14 163.83,8.89 C4.1 184.15,8.89 E5.13 | E18.14 E18.13 185.42,49.53 | E18.4 177.8,53.34 177.8,49.53 179.07,49.53 | C17.1 185.42,49.53 | 185.42,49.53 179.07,49.53 | C5.1 189.23,7.62 E5.14 | E17.14 163.83,49.53 C16.1 | C10.1 184.15,29.21 E12.13 | U$2.A2 8.26,4.45 22.23,4.45 18.+ 24.13,6.35 36.83,6.35 R3.2 39.37,6.35 72.39,6.35 | E16.14 138.43,49.53 C15.1 | R4.1 R7.2 | E11.8 140.97,27.94 C9.1 138.43,29.21 E10.14 135.89,26.67 116.84,26.67 C8.1 113.03,29.21 | E6.14 41.91,26.67 59.69,26.67 E7.14 62.23,27.94 C6.1 66.04,26.67 85.09,26.67 E8.14 87.63,29.21 C7.1 113.03,29.21 | E13.14 62.23,49.53 C12.1 | v66.04,52.07 v85.73,52.07 v109.22,52.07 | 72.39,6.35 74.93,3.81 R10.1 | 72.39,6.35 E1.8 | E15.14 113.03,49.53 C14.1 | C2.1 113.03,8.89 E2.14 110.49,6.35 91.44,6.35 C1.1 | 113.03,29.21 E9.14 | 179.07,49.53 179.07,44.45 140.97,44.45 R5.2
VECTOR_BIT_02_H  (via drill 0.81)
  Top 0.406: v106.68,24.13 E9.12 | v78.74,22.86 72.39,16.51 v72.39,13.97 | v40.01,15.24 v42.55,12.7
  Bottom 0.406: v106.68,24.13 105.41,22.86 v78.74,22.86 | v72.39,13.97 71.12,12.7 v42.55,12.7 | v40.01,15.24 38.74,16.51 17.15,16.51 14.61,13.97 8.26,13.97 U$2.D2

### Text on the board
Top: M7821 Interrupt Control
Bottom: M7821 Interrupt Control